# Altium project PCB_Project.PrjPcb
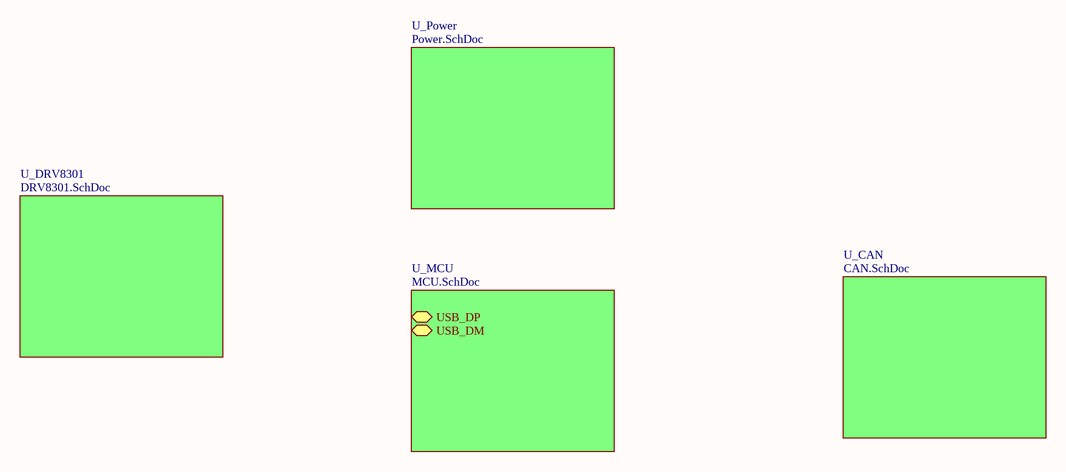
[diagram p0: Main.SchDoc]
6 sheets, 106 parts. Net scope: hierarchical (ports join the sheet entries above them; power ports are global).
Board file: PCB1.PcbDoc
Sheets:
  Main.SchDoc
    U_DRV8301 = DRV8301.SchDoc
    U_MCU = MCU.SchDoc
    U_CAN = CAN.SchDoc
    U_Power = Power.SchDoc
  NRF.SchDoc

## Sheet Main.SchDoc
size A4

### Sub-sheets
U_CAN = CAN.SchDoc: no entries
U_DRV8301 = DRV8301.SchDoc: no entries
U_MCU = MCU.SchDoc: USB_DP (bidir), USB_DM (bidir)
U_Power = Power.SchDoc: no entries

## Sheet DRV8301.SchDoc
size A4
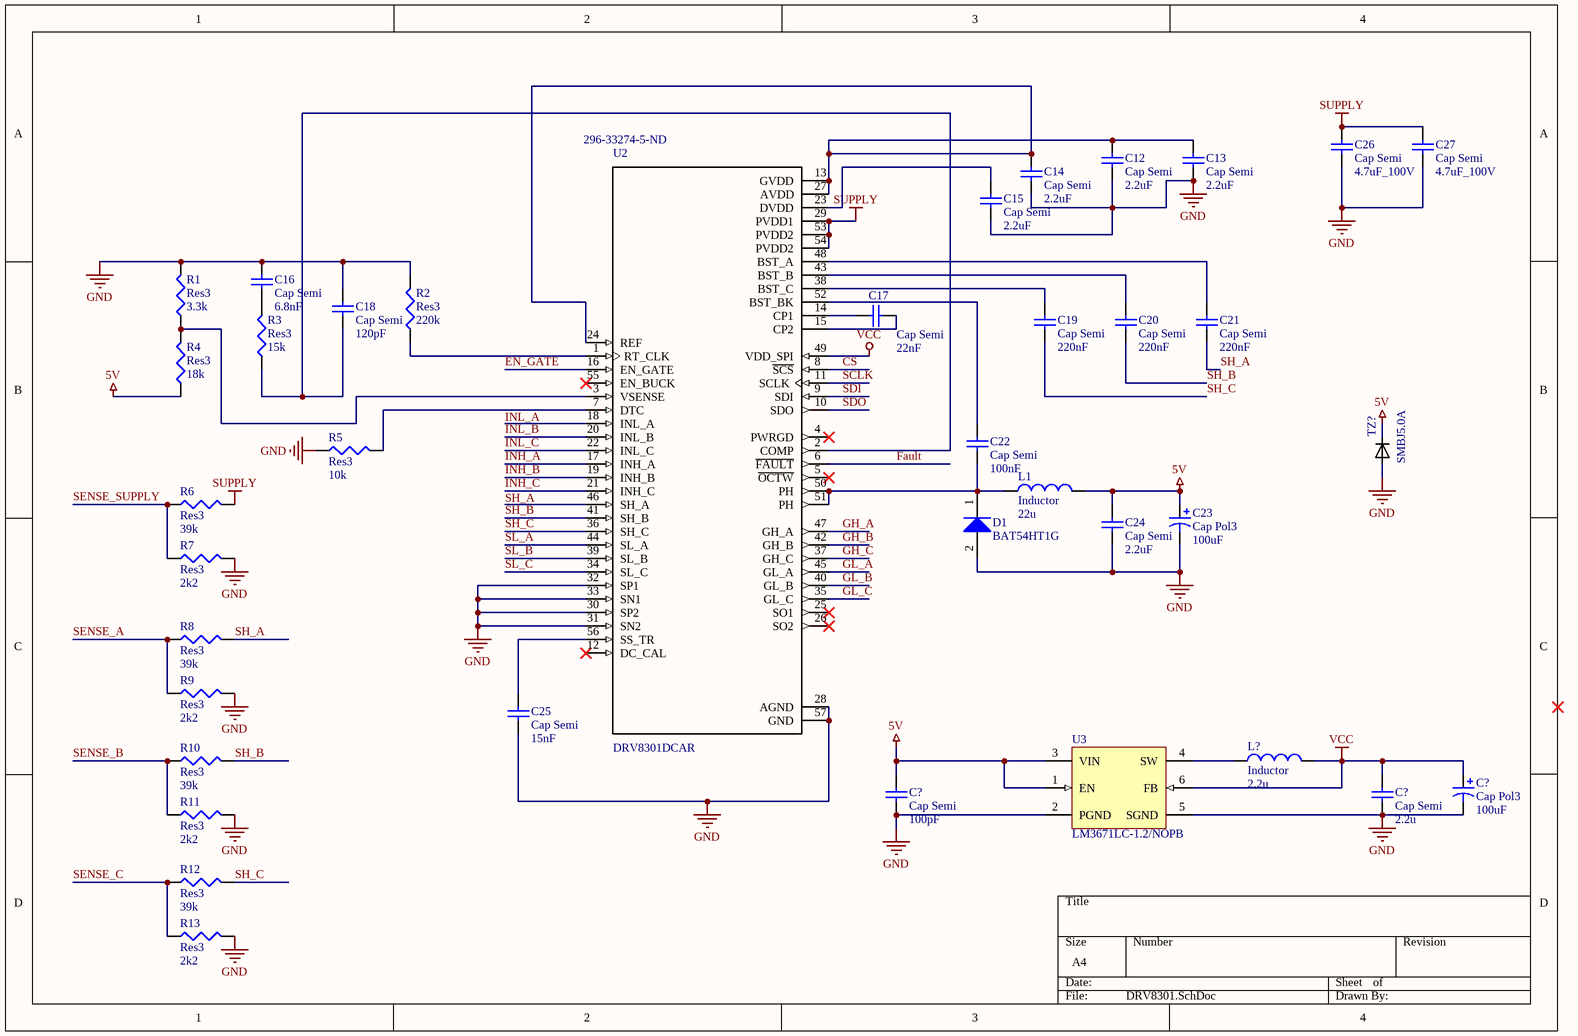
[diagram p1: DRV8301.SchDoc]

### Parts
(Parts that share a designator on the sheet are numbered #1, #2 ... from top to bottom, then left to right.)
C12  Cap Semi  value 2.2uF  [C1206]
C13  Cap Semi  value 2.2uF  [C1206]
C14  Cap Semi  value 2.2uF  [C1206]
C15  Cap Semi  value 2.2uF  [C1206]
C16  Cap Semi  value 6.8nF  [C1206]
C17  Cap Semi  value 22nF  [C1206]
C18  Cap Semi  value 120pF  [C1206]
C19  Cap Semi  value 220nF  [C1206]
C20  Cap Semi  value 220nF  [C1206]
C21  Cap Semi  value 220nF  [C1206]
C22  Cap Semi  value 100nF  [C1206]
C23  Cap Pol3  value 100uF  [C0805]
C24  Cap Semi  value 2.2uF  [C1206]
C25  Cap Semi  value 15nF  [C1206]
C26  Cap Semi  value 4.7uF_100V  [C1206]
C27  Cap Semi  value 4.7uF_100V  [C1206]
C?#1  Cap Pol3  value 100uF  [C0805]
C?#2  Cap Semi  value 100pF  [C1206]
C?#3  Cap Semi  value 2.2u  [C1206]
D1  BAT54HT1G  [ONSC-SOD-323-2-477-02_V]
L1  Inductor  value 22u  [0402-A]
L?  Inductor  value 2.2u  [0402-A]
R1  Res3  value 3.3k  [J1-0603]
R2  Res3  value 220k  [J1-0603]
R3  Res3  value 15k  [J1-0603]
R4  Res3  value 18k  [J1-0603]
R5  Res3  value 10k  [J1-0603]
R6  Res3  value 39k  [J1-0603]
R7  Res3  value 2k2  [J1-0603]
R8  Res3  value 39k  [J1-0603]
R9  Res3  value 2k2  [J1-0603]
R10  Res3  value 39k  [J1-0603]
R11  Res3  value 2k2  [J1-0603]
R12  Res3  value 39k  [J1-0603]
R13  Res3  value 2k2  [J1-0603]
TZ?  SMBJ5.0A  [*SMB_SMBJ5.0A(Primary)]
U2  DRV8301DCAR  Supplier Part Number 1: 296-33274-5-ND  [*SOP50P810X120-57N]
U3  LM3671LC-1.2/NOPB  [NKH0006B_V]

### Nets
5V: C23.1 C24.2 C?#2.2 L1.2 R4.1 TZ?.C U3.1(EN) U3.3(VIN)
GND: C12.2 C13.2 C14.2 C15.2 C16.2 C18.2 C23.2 C24.1 C25.2 C26.1 C27.1 C?#1.2 C?#2.1 C?#3.1 D1.2(A) R1.2 R2.2 R5.1 R7.2 R9.2 R11.2 R13.2 TZ?.A U2.28(AGND) U2.30(SP2) U2.31(SN2) U2.32(SP1) U2.33(SN1) U2.57(GND) U3.2(PGND) U3.5(SGND)
SUPPLY: C26.2 C27.2 R6.2 U2.29(PVDD1) U2.53(PVDD2) U2.54(PVDD2)
VCC: C?#1.1 C?#3.2 L?.2 U2.49(VDD_SPI) U3.6(FB)
CS: U2.8(~{SCS})
EN_GATE: U2.16(EN_GATE)
Fault: U2.6(~{FAULT})
GH_A: U2.47(GH_A)
GH_B: U2.42(GH_B)
GH_C: U2.37(GH_C)
GL_A: U2.45(GL_A)
GL_B: U2.40(GL_B)
GL_C: U2.35(GL_C)
INH_A: U2.17(INH_A)
INH_B: U2.19(INH_B)
INH_C: U2.21(INH_C)
INL_B: U2.20(INL_B)
INL_C: U2.22(INL_C)
SCLK: U2.11(SCLK)
SDI: U2.9(SDI)
SDO: U2.10(SDO)
SENSE_A: R8.1 R9.1
SENSE_B: R10.1 R11.1
SENSE_C: R12.1 R13.1
SENSE_SUPPLY: R6.1 R7.1
SH_A: C21.2 R8.2
SH_B: C20.2 R10.2 U2.41(SH_B)
SH_C: C19.2 R12.2 U2.36(SH_C)
SL_A: U2.44(SL_A)
SL_B: U2.39(SL_B)
SL_C: U2.34(SL_C)
NetC12_1: C12.1 C13.1 C14.1 U2.13(GVDD) U2.24(REF) U2.27(AVDD)
NetC15_1: C15.1 U2.23(DVDD)
NetC16_1: C16.1 R3.2
NetC17_1: C17.1 U2.14(CP1)
NetC17_2: C17.2 U2.15(CP2)
NetC18_1: C18.1 R3.1 U2.2(COMP)
NetC19_1: C19.1 U2.38(BST_C)
NetC20_1: C20.1 U2.43(BST_B)
NetC21_1: C21.1 U2.48(BST_A)
NetC22_1: C22.1 D1.1(K) L1.1 U2.50(PH) U2.51(PH)
NetC22_2: C22.2 U2.52(BST_BK)
NetC25_1: C25.1 U2.56(SS_TR)
NetL?_1: L?.1 U3.4(SW)
NetR1_1: R1.1 R4.2 U2.3(VSENSE)
NetR2_1: R2.1 U2.1(RT_CLK)
NetR5_2: R5.2 U2.7(DTC)

Not connected (* = marked no-connect by the designer): U2 4(PWRGD)* 5(~{OCTW})* 12(DC_CAL)* 18(INL_A) 25(SO1)* 26(SO2)* 46(SH_A) 55(EN_BUCK)*

### Notes on the sheet
- Labels drawn without touching a wire or pin: INL_A, SH_A

### Library data of the parts
C12-C22 C24-C27 C?#2 C?#3 = Cap Semi: Capacitor (Semiconductor SIM Model); Published: 8-Jun-2000; LatestRevisionDate: 29-May-2009; LatestRevisionNote: IPC-7351 Footprint Added.; PackageReference: C1206; Publisher: Altium Limited; PackageDescription: Chip Capacitor
C23 C?#1 = Cap Pol3: Polarized Capacitor (Surface Mount); Published: 8-Jun-2000; LatestRevisionDate: 29-May-2009; LatestRevisionNote: IPC-7351 Footprint Added.; PackageReference: C0805; Publisher: Altium Limited; PackageDescription: Chip Capacitor
D1 = CMP-1055-00462-1: Schottky Barrier Diode, 2-Pin SOD-323, Pb-Free, Tape and Reel; Manufacturer: On Semiconductor; Configuration: Single; trr Max (ns): 5; IFSM Max (A): 0.6; ComponentLink3URL: http://www.onsemi.com/pub_link/Collateral/477-02.PDF.1; PackageDescription: 2-Pin SOD, Body 1.7 x 1.25 mm; ComponentLink2URL: http://www.onsemi.cn/pub_link/Collateral/BAT54HT1-D.PDF; ComponentLink3Description: Package Specification; ComponentLink2Description: Datasheet; DatasheetVersion: Rev. 6; PackageReference: SOD-323-2-477-02; RoHS: TRUE; ComponentLink1URL: http://www.onsemi.com/; Packing: Tape and Reel; PartNumber: BAT54HT1G; Mounting Technology: Surface Mount; ComponentLink1Description: Manufacturer URL; PackageVersion: Rev. H, 03/2007
L1 L? = Inductor: Code_IEC: 1005; Published: 8-Jun-2000; LatestRevisionDate: 29-May-2009; LatestRevisionNote: IPC-7351 Footprint Added.; PackageReference: 0402-A; Publisher: Altium Limited; PackageDescription: Chip Inductor; Code_JEITA: 0402
R1-R13 = Res3: Resistor; Published: 8-Jun-2000; LatestRevisionDate: 29-May-2009; LatestRevisionNote: IPC-7351 Footprint Added.; PackageReference: J1-0603; Publisher: Altium Limited; PackageDescription: Chip Resistor
TZ? = SMBJ5.0A: 9.2V Clamp 65.3A Ipp Tvs Diode Surface Mount SMB _DO-214AA_; MF: Littelfuse; SnapEDA_Link: https://www.snapeda.com/parts/SMBJ5.0A/Littelfuse%20Inc/view-part/225678/?ref=snap; Price: None; Availability: Unavailable; MP: SMBJ5.0A; Package: DO-214 Bourns; Value: *
U2 = DRV8301DCAR: Motor Driver Power MOSFET SPI 56-HTSSOP; MF: Texas Instruments; MP: DRV8301DCAR; Package: HTSSOP-56 Texas Instruments; SnapEDA_Link: https://www.snapeda.com/parts/DRV8301DCAR/Texas%20Instruments/view-part/46687/?ref=snap; Price: None; Availability: Unavailable; Value: *; Supplier 1: Digi-Key
U3 = CMP-0063-00712-3: 2MHz, 600mA Step-Down DC-DC Converter, 6-pin LLP COL, Pb-Free; Manufacturer: Texas Instruments; PackageTopMarking: XTT*S39; PowerWise: N; CompType: MiscPower; RoHS: Y; PackageReference: NKH0006B; ComponentLink1URL: http://www.ti.com/general/docs/lit/getliterature.tsp?genericPartNumber=LM3671&fileType=pdf; PinCount: 6; PackageDescription: LLP, 2 x 2 x 0.6mm, 6 Lead, 0.5mm Pitch, No Pullback; ComponentLink1Description: Datasheet URL

## Sheet MCU.SchDoc
size A4
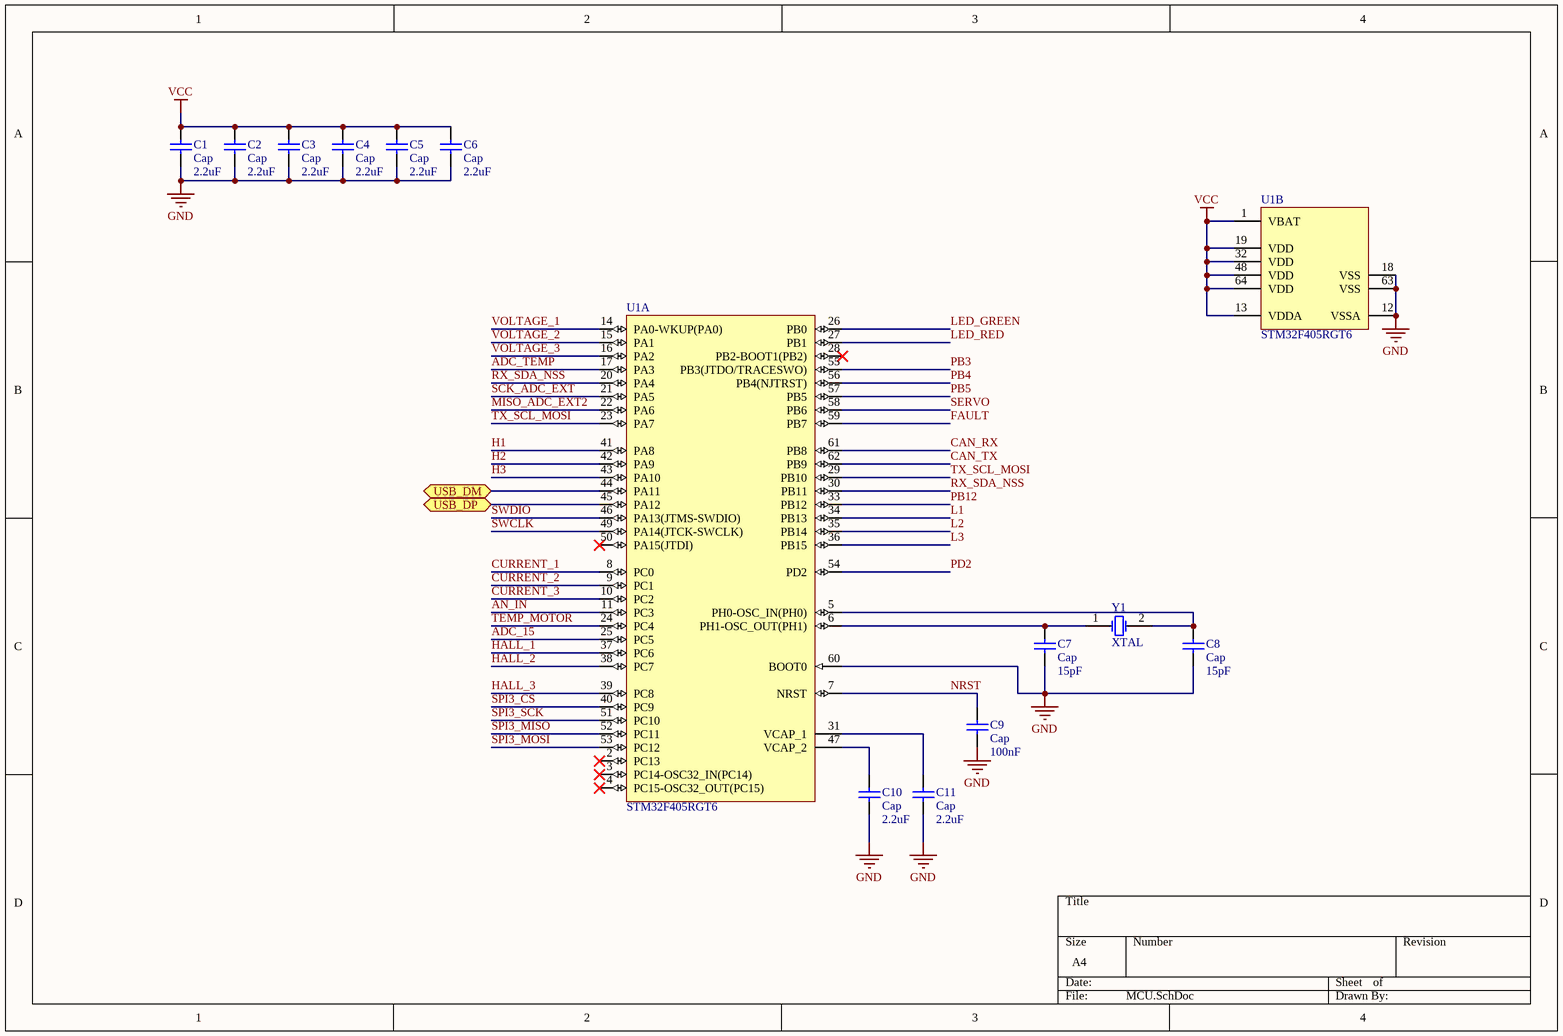
[diagram p2: MCU.SchDoc]

### Parts
C1  Cap  value 2.2uF  [RAD-0.3]
C2  Cap  value 2.2uF  [RAD-0.3]
C3  Cap  value 2.2uF  [RAD-0.3]
C4  Cap  value 2.2uF  [RAD-0.3]
C5  Cap  value 2.2uF  [RAD-0.3]
C6  Cap  value 2.2uF  [RAD-0.3]
C7  Cap  value 15pF  [RAD-0.3]
C8  Cap  value 15pF  [RAD-0.3]
C9  Cap  value 100nF  [RAD-0.3]
C10  Cap  value 2.2uF  [RAD-0.3]
C11  Cap  value 2.2uF  [RAD-0.3]
U1  STM32F405RGT6  [STM-LQFP64_M]  (parts A,B of 2)
Y1  XTAL  [R38]

### Ports
USB_DM (bidir), USB_DP (bidir)

### Nets
GND: C1.1 C2.1 C3.1 C4.1 C5.1 C6.1 C7.1 C8.1 C9.1 C10.1 C11.1 U1.12(VSSA) U1.18(VSS) U1.60(BOOT0) U1.63(VSS)
VCC: C1.2 C2.2 C3.2 C4.2 C5.2 C6.2 U1.1(VBAT) U1.13(VDDA) U1.19(VDD) U1.32(VDD) U1.48(VDD) U1.64(VDD)
ADC_15: U1.25(PC5)
ADC_TEMP: U1.17(PA3)
AN_IN: U1.11(PC3)
CAN_RX: U1.61(PB8)
CAN_TX: U1.62(PB9)
CURRENT_1: U1.8(PC0)
CURRENT_2: U1.9(PC1)
CURRENT_3: U1.10(PC2)
FAULT: U1.59(PB7)
H1: U1.41(PA8)
H2: U1.42(PA9)
H3: U1.43(PA10)
HALL_1: U1.37(PC6)
HALL_2: U1.38(PC7)
HALL_3: U1.39(PC8)
L1: U1.34(PB13)
L2: U1.35(PB14)
L3: U1.36(PB15)
LED_GREEN: U1.26(PB0)
LED_RED: U1.27(PB1)
MISO_ADC_EXT2: U1.22(PA6)
NRST: C9.2 U1.7(NRST)
PB3: U1.55(PB3(JTDO/TRACESWO))
PB4: U1.56(PB4(NJTRST))
PB5: U1.57(PB5)
PB12: U1.33(PB12)
PD2: U1.54(PD2)
RX_SDA_NSS: U1.20(PA4) U1.30(PB11)
SCK_ADC_EXT: U1.21(PA5)
SERVO: U1.58(PB6)
SPI3_CS: U1.40(PC9)
SPI3_MISO: U1.52(PC11)
SPI3_MOSI: U1.53(PC12)
SPI3_SCK: U1.51(PC10)
SWCLK: U1.49(PA14(JTCK-SWCLK))
SWDIO: U1.46(PA13(JTMS-SWDIO))
TEMP_MOTOR: U1.24(PC4)
TX_SCL_MOSI: U1.23(PA7) U1.29(PB10)
VOLTAGE_1: U1.14(PA0-WKUP(PA0))
VOLTAGE_2: U1.15(PA1)
VOLTAGE_3: U1.16(PA2)
NetC7_2: C7.2 U1.6(PH1-OSC_OUT(PH1)) Y1.1(OSC1)
NetC8_2: C8.2 U1.5(PH0-OSC_IN(PH0)) Y1.2(OSC2)
NetC10_2: C10.2 U1.47(VCAP_2)
NetC11_2: C11.2 U1.31(VCAP_1)
NetU1_44: U1.44(PA11) ; port USB_DM
NetU1_45: U1.45(PA12) ; port USB_DP

Not connected (* = marked no-connect by the designer): U1 2(PC13)* 3(PC14-OSC32_IN(PC14))* 4(PC15-OSC32_OUT(PC15))* 28(PB2-BOOT1(PB2))* 50(PA15(JTDI))*

### Library data of the parts
C1-C11 = Cap: Capacitor; Published: 8-Jun-2000; LatestRevisionDate: 17-Jul-2002; LatestRevisionNote: Re-released for DXP Platform.; PackageReference: RAD-0.3; Publisher: Altium Limited; PackageDescription: Radial Cap, Thru-Hole; 2 Leads; 0.3 in Pin Spacing
U1 = CMP-0243-00019-3: ARM Cortex-M4 32-bit MCU+FPU, 210 DMIPS, 1024 kB Flash, 192 kB Internal RAM, 51 I/Os, 64-pin LQFP, -40 to 85 degC, Tray; Manufacturer: STMicroelectronics; Supply Voltage(Vcc) min (V): 1.8; Supply Voltage(Vcc) max (V): 3.6; Internal RAM Size (kB): 192; I/Os (High Current): 51; D/A Converter: 2x12-bit; FLASH Size (Prog) (kB): 1024; Operating Frequency(F) (Processor speed) (MHz): 168; ComponentLink2Description: Datasheet; PackageVersion: Rev. 4, 06/2013; DatasheetVersion: Rev. 4; Core: ARM Cortex-M4; ComponentLink2URL: http://www.st.com/st-web-ui/static/active/en/resource/technical/document/datasheet/DM00037051.pdf; PackageReference: LQFP64; Packing: Tray; ComponentLink1Description: Manufacturer URL; ComponentLink3URL: http://www.st.com/st-web-ui/static/active/en/resource/technical/document/datasheet/DM00037051.pdf; ComponentLink3Description: Package Specification; Mounting Technology: Surface Mount; ComponentLink1URL: http://www.st.com/web/en/home.html; PackageDescription: 64-Pin Low Profile Quad Flat Package, 10 x 10 mm Body, 0.5 mm Pitch; PartNumber: STM32F405RGT6
Y1 = XTAL: Crystal Oscillator; Published: 8-Jun-2000; LatestRevisionDate: 17-Jul-2002; LatestRevisionNote: Re-released for DXP Platform.; PackageReference: R38; Publisher: Altium Limited; PackageDescription: Crystal, Thru-Hole; 2 Leads; Body 3.1 x 8.2 mm (Dia.xH)

## Sheet CAN.SchDoc
size A4
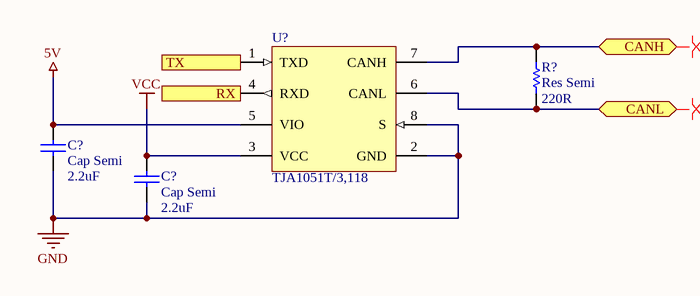
[diagram p3: CAN.SchDoc]

### Parts
(Parts that share a designator on the sheet are numbered #1, #2 ... from top to bottom, then left to right.)
C?#4  Cap Semi  value 2.2uF  [C1206]
C?#5  Cap Semi  value 2.2uF  [C1206]
R?#1  Res Semi  value 220R  [AXIAL-0.5]
U?#1  TJA1051T/3,118  [NXP-SOIC-8_L]

### Ports
CANH (bidir), CANL (bidir), RX (out), TX (in)

### Nets
5V: C?#4.1 U?#1.5(VIO)
GND: C?#4.2 C?#5.1 U?#1.2(GND) U?#1.8(S)
VCC: C?#5.2 U?#1.3(VCC)
NetR?#1_1: R?#1.1 U?#1.6(CANL) ; port CANL
NetR?#1_2: R?#1.2 U?#1.7(CANH) ; port CANH
NetU?#1_1: U?#1.1(TXD) ; port TX
NetU?#1_4: U?#1.4(RXD) ; port RX

### Layout directives
differential pair: NetR?#1_1, NetR?#1_2

### Library data of the parts
C?#4 C?#5 = Cap Semi: Capacitor (Semiconductor SIM Model); Published: 8-Jun-2000; LatestRevisionDate: 29-May-2009; LatestRevisionNote: IPC-7351 Footprint Added.; PackageReference: C1206; Publisher: Altium Limited; PackageDescription: Chip Capacitor
R?#1 = Res Semi: Semiconductor Resistor; Published: 8-Jun-2000; LatestRevisionDate: 17-Jul-2002; LatestRevisionNote: Re-released for DXP Platform.; PackageReference: AXIAL-0.5; Publisher: Altium Limited; PackageDescription: Axial Device, Thru-Hole; 2 Leads; 0.5 in Pin Spacing
U?#1 = CMP-2000-07245-1: High-Speed CAN Transceiver, 3 to 5 V, 8-Pin SOIC (SOT96-1), RoHS, Tape and Reel; Manufacturer: NXP; Power Down Mode: Normal/Silent; Rad Hardened: No; Number of Transceivers: 1; Supply Current: 70mA; Operating Supply Voltage (Max): 5.5V; Operating Supply Voltage (Typ): 5V; Operating Supply Voltage (Min): 4.5V; Standard Supported: ISO11898-2; Data Rate: 1Mbps; DELETED: Compliant; Operating Temperature (Min): -40C; Datasheet Version: Rev. 7, 01/2015; Pin Count: 8; Operating Temperature (Max): 125C; Package Description: 8-Pin Small Outline Integrated Circuit, Body 4.9 x 3.9 mm, Pitch 1.27 mm; Category: Transceiver; Packaging: TapeandReel; Mounting: SurfaceMount; Package Reference: SOT96-1; Operating Temperature Classification: Automotive; Mounting Technology: SurfaceMount; Package Type: SO; Manufacturer URL: http://www.nxp.com/; Datasheet URL: http://www.nxp.com/documents/data_sheet/TJA1051.pdf

## Sheet Power.SchDoc
size A4
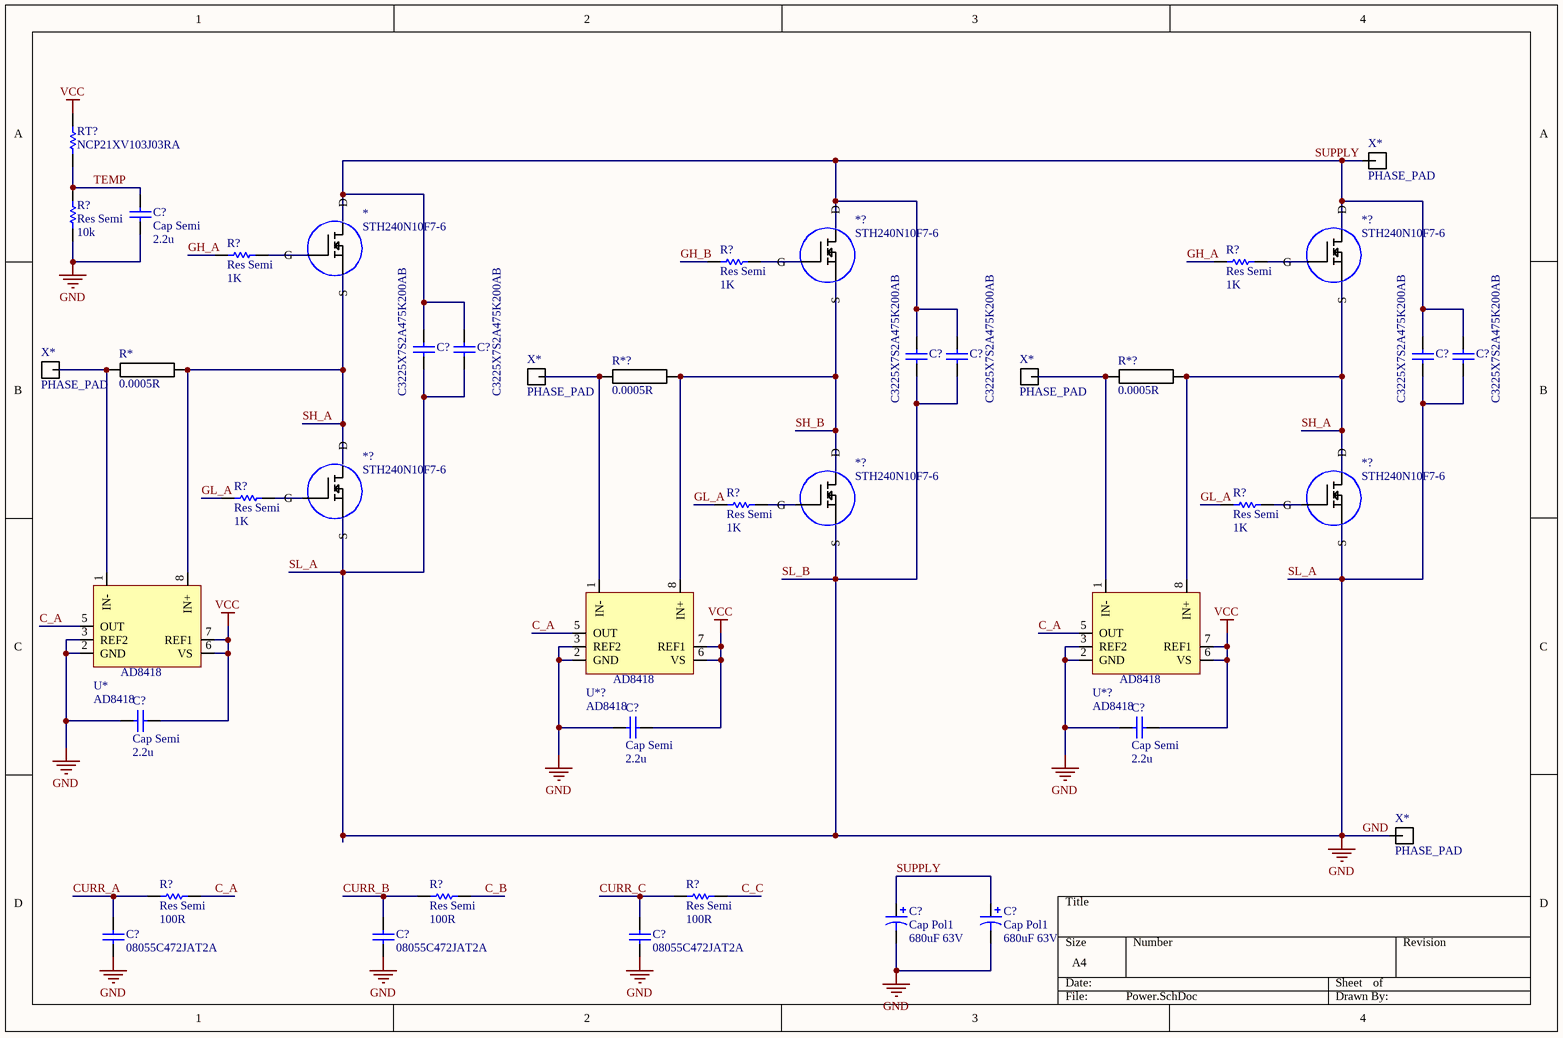
[diagram p4: Power.SchDoc]

### Parts
(Parts that share a designator on the sheet are numbered #1, #2 ... from top to bottom, then left to right.)
*  STH240N10F7-6  [*TO-263-7]
*?#1  STH240N10F7-6  [*TO-263-7]
*?#2  STH240N10F7-6  [*TO-263-7]
*?#3  STH240N10F7-6  [*TO-263-7]
*?#4  STH240N10F7-6  [*TO-263-7]
*?#5  STH240N10F7-6  [*TO-263-7]
C?#6  Cap Semi  value 2.2u  [C1206]
C?#7  C3225X7S2A475K200AB  [CAPC3225X220X20ML40]
C?#8  C3225X7S2A475K200AB  [CAPC3225X220X20ML40]
C?#9  C3225X7S2A475K200AB  [CAPC3225X220X20ML40]
C?#10  C3225X7S2A475K200AB  [CAPC3225X220X20ML40]
C?#11  C3225X7S2A475K200AB  [CAPC3225X220X20ML40]
C?#12  C3225X7S2A475K200AB  [CAPC3225X220X20ML40]
C?#13  Cap Semi  value 2.2u  [C1206]
C?#14  Cap Semi  value 2.2u  [C1206]
C?#15  Cap Semi  value 2.2u  [C1206]
C?#16  Cap Pol1  value 680uF 63V  [RB7.6-15]
C?#17  Cap Pol1  value 680uF 63V  [RB7.6-15]
C?#18  08055C472JAT2A  [CAPC2013X94X50NL20T25]
C?#19  08055C472JAT2A  [CAPC2013X94X50NL20T25]
C?#20  08055C472JAT2A  [CAPC2013X94X50NL20T25]
R*  0.0005R  [*RESC5125X80N]
R*?#1  0.0005R  [*RESC5125X80N]
R*?#2  0.0005R  [*RESC5125X80N]
R?#2  Res Semi  value 10k  [AXIAL-0.5]
R?#3  Res Semi  value 1K  [AXIAL-0.5]
R?#4  Res Semi  value 1K  [AXIAL-0.5]
R?#5  Res Semi  value 1K  [AXIAL-0.5]
R?#6  Res Semi  value 1K  [AXIAL-0.5]
R?#7  Res Semi  value 1K  [AXIAL-0.5]
R?#8  Res Semi  value 1K  [AXIAL-0.5]
R?#9  Res Semi  value 100R  [AXIAL-0.5]
R?#10  Res Semi  value 100R  [AXIAL-0.5]
R?#11  Res Semi  value 100R  [AXIAL-0.5]
RT?  NCP21XV103J03RA  [RESC2013X100X45LL20T25]
U*  AD8418  [*SOP65P490X110-8N]
U*?#1  AD8418  [*SOP65P490X110-8N]
U*?#2  AD8418  [*SOP65P490X110-8N]
X*#1  PHASE_PAD  [PHASE_PAD]
X*#2  PHASE_PAD  [PHASE_PAD]
X*#3  PHASE_PAD  [PHASE_PAD]
X*#4  PHASE_PAD  [PHASE_PAD]
X*#5  PHASE_PAD  [PHASE_PAD]

### Nets
GND: *?#3.S *?#4.S *?#5.S C?#6.1 C?#7.1 C?#8.1 C?#9.1 C?#10.1 C?#11.1 C?#12.1 C?#13.1 C?#14.1 C?#15.1 C?#16.2 C?#17.2 C?#18.1 C?#19.1 C?#20.1 R?#2.1 U*.2(GND) U*.3(REF2) U*?#1.2(GND) U*?#1.3(REF2) U*?#2.2(GND) U*?#2.3(REF2)  [also labelled SL_A, SL_B]
VCC: C?#13.2 C?#14.2 C?#15.2 RT?.2 U*.6(VS) U*.7(REF1) U*?#1.6(VS) U*?#1.7(REF1) U*?#2.6(VS) U*?#2.7(REF1)
C_A: R?#9.2 U*.5(OUT) U*?#1.5(OUT) U*?#2.5(OUT)
C_B: R?#10.2
C_C: R?#11.2
CURR_A: C?#18.2 R?#9.1
CURR_B: C?#19.2 R?#10.1
CURR_C: C?#20.2 R?#11.1
GH_A: R?#3.1 R?#5.1
GH_B: R?#4.1
GL_A: R?#6.1 R?#7.1 R?#8.1
SH_A: *.S *?#2.S *?#3.D *?#5.D R*.1 R*?#2.1 U*.8(IN+) U*?#2.8(IN+)
SH_B: *?#1.S *?#4.D R*?#1.1 U*?#1.8(IN+)
SUPPLY: *.D *?#1.D *?#2.D C?#7.2 C?#8.2 C?#9.2 C?#10.2 C?#11.2 C?#12.2 C?#16.1 C?#17.1
TEMP: C?#6.2 R?#2.2 RT?.1
Net*?#1_G: *?#1.G R?#4.2
Net*?#2_G: *?#2.G R?#5.2
Net*_G: *.G R?#3.2
NetR*?#1_2: R*?#1.2 U*?#1.1(IN-) X*#3.1
NetR*?#2_2: R*?#2.2 U*?#2.1(IN-) X*#4.1
NetR*_2: R*.2 U*.1(IN-) X*#2.1

Not connected (* = marked no-connect by the designer): *?#3 G; *?#4 G; *?#5 G; R?#6 2; R?#7 2; R?#8 2; X*#1 1; X*#5 1

### Library data of the parts
C?#6 C?#13-C?#15 = Cap Semi: Capacitor (Semiconductor SIM Model); Published: 8-Jun-2000; LatestRevisionDate: 29-May-2009; LatestRevisionNote: IPC-7351 Footprint Added.; PackageReference: C1206; Publisher: Altium Limited; PackageDescription: Chip Capacitor
C?#7-C?#12 = CMP-2000-05456-1: Chip Capacitor, 4.7 uF, +/- 10%, 100 V, -55 to 125 degC, 1210 (3225 Metric), RoHS, Tape and Reel; PCN Part Number: MLCCPartNumberChange30/Nov/2012; Manufacturer: TDK; Featured Product: MidVoltageX7S-100VMLCCsC-SeriesMidVoltageMLCCs; Capacitance: 4.7µF; Catalog Drawings: CSERIES_1210_2.2; Product Training Modules: SEAT,CCV,andTVCLDesignToolsCSeriesMidVoltageCapacitorsFamilyGuidetoReplacinganElectrolyticCapacitorwithanMLCC; Voltage - Rated: 100V; Temperature Coefficient: X7S; Other Names: 445-6042-1; Online Catalog: CSeries,MidVoltage; Kits: 445-9009-KIT-ND-KITCAPCERHICAP100V-630VSMD; Mounting Type: SurfaceMount,MLCC; Ratings: -; Lead Spacing: -; Package Reference: 3225; Thickness (Max): 0.087"(2.20mm); Features: -; Category: Capacitors; Size / Dimension: 0.126"Lx0.098"W(3.20mmx2.50mm); Tolerance: ±10%; Series: C; Datasheet URL: http://download.siliconexpert.com/pdfs/2013/1/31/7/41/13/446/tdk_/manual/c3225x7s2a475k200ab.pdf; Lead Style: -; Manufacturer URL: http://www.tdk.com/; RoHS Information: RoHSCertificate-MLCC; Datasheet Version: Jan-13; Package / Case: 1210(3225Metric); Package Description: 2-Pin Surface Mount Device, Body 3.2 x 2.5 mm; Standard Package: 1; Applications: GeneralPurpose; Packaging: CutTape(CT); Family: CeramicCapacitors; Height - Seated (Max): -; Operating Temperature: -55degC~125degC
C?#16 C?#17 = Cap Pol1: Polarized Capacitor (Radial); Published: 8-Jun-2000; LatestRevisionDate: 17-Jul-2002; LatestRevisionNote: Re-released for DXP Platform.; PackageReference: RB7.6-15; Publisher: Altium Limited; PackageDescription: Polarized Capacitor (Radial); 2 Leads
C?#18-C?#20 = CMP-2007-04421-1: Manufacturer: AVX Interconnect / Elco; Part Number: 08055C472JAT2A
R?#2-R?#11 = Res Semi: Semiconductor Resistor; Published: 8-Jun-2000; LatestRevisionDate: 17-Jul-2002; LatestRevisionNote: Re-released for DXP Platform.; PackageReference: AXIAL-0.5; Publisher: Altium Limited; PackageDescription: Axial Device, Thru-Hole; 2 Leads; 0.5 in Pin Spacing
RT? = CMP-2000-06827-1: Chip Thermistor, 10 KOhm, +/- 5%, 200 mW, -40 to 125 degC, 0805 (2012 Metric), RoHS, Tape and Reel; Manufacturer: Murata; Rated Current: 0.44mA; B-constant: 3934K; Resistance: 10kO; Datasheet URL: http://www.murata.com/~/media/webrenewal/support/library/catalog/products/thermistor/ntc/r44e.ashx; Tolerance (%): ±5%; Package Description: 2-Pin Surface Mount Device, Body 2 x 1.25 mm; Temperature Range: -40to+125°C; Manufacturer URL: http://www.murata.com/; Mounting Technology: SurfaceMount; Type: NTC; Package Reference: 0805; Datasheet Version: 12/2014

## Sheet NRF.SchDoc
size A4
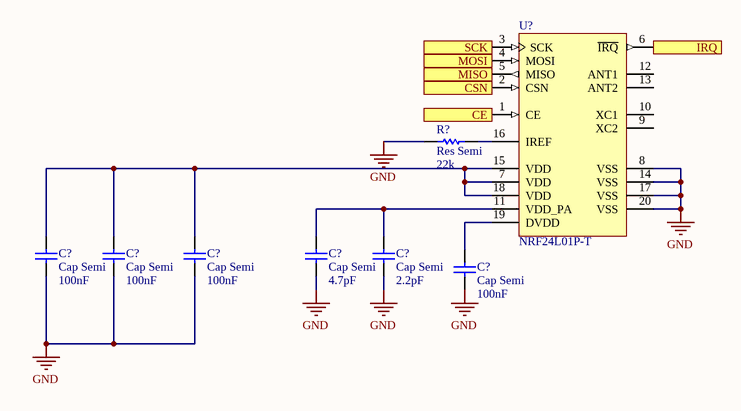
[diagram p5: NRF.SchDoc]

### Parts
(Parts that share a designator on the sheet are numbered #1, #2 ... from top to bottom, then left to right.)
C?#21  Cap Semi  value 100nF  [C1206]
C?#22  Cap Semi  value 100nF  [C1206]
C?#23  Cap Semi  value 100nF  [C1206]
C?#24  Cap Semi  value 4.7pF  [C1206]
C?#25  Cap Semi  value 2.2pF  [C1206]
C?#26  Cap Semi  value 100nF  [C1206]
R?#12  Res Semi  value 22k  [AXIAL-0.5]
U?#2  NRF24L01P-T  [NRSC-QFN-20_L]

### Ports
CE (in), CSN (in), IRQ (out), MISO (out), MOSI (in), SCK (in)

### Nets
GND: C?#21.1 C?#22.1 C?#23.1 C?#24.1 C?#25.1 C?#26.1 R?#12.1 U?#2.8(VSS) U?#2.14(VSS) U?#2.17(VSS) U?#2.20(VSS)
NetC?#21_2: C?#21.2 C?#22.2 C?#23.2 U?#2.7(VDD) U?#2.15(VDD) U?#2.18(VDD)
NetC?#24_2: C?#24.2 C?#25.2 U?#2.11(VDD_PA)
NetC?#26_2: C?#26.2 U?#2.19(DVDD)
NetR?#12_2: R?#12.2 U?#2.16(IREF)
NetU?#2_1: U?#2.1(CE) ; port CE
NetU?#2_2: U?#2.2(CSN) ; port CSN
NetU?#2_3: U?#2.3(SCK) ; port SCK
NetU?#2_4: U?#2.4(MOSI) ; port MOSI
NetU?#2_5: U?#2.5(MISO) ; port MISO
NetU?#2_6: U?#2.6(~{IRQ}) ; port IRQ

Not connected (* = marked no-connect by the designer): U?#2 9(XC2) 10(XC1) 12(ANT1) 13(ANT2)

### Library data of the parts
C?#21-C?#26 = Cap Semi: Capacitor (Semiconductor SIM Model); Published: 8-Jun-2000; LatestRevisionDate: 29-May-2009; LatestRevisionNote: IPC-7351 Footprint Added.; PackageReference: C1206; Publisher: Altium Limited; PackageDescription: Chip Capacitor
R?#12 = Res Semi: Semiconductor Resistor; Published: 8-Jun-2000; LatestRevisionDate: 17-Jul-2002; LatestRevisionNote: Re-released for DXP Platform.; PackageReference: AXIAL-0.5; Publisher: Altium Limited; PackageDescription: Axial Device, Thru-Hole; 2 Leads; 0.5 in Pin Spacing
U?#2 = CMP-2000-06859-1: Single Chip Transceiver, 2.4 GHz, 60 mW, 1.9 to 3.6 V, -40 to 85 degC, 20-Pin QFN, RoHS, Tray; Manufacturer: Nordic Semiconductor; Data Rate (Max): 2Mbps; Current - Transmitting: 7mA~11.3mA; Power - Output: 0dBm; Other Names: 1490-1019; Online Catalog: nRF24L01+; Current - Receiving: 12.6mA~13.5mA; For Use With: 1490-1002-ND-KITEVALUATIONNRF24L01P1568-1295-ND-SPARKFUNTRANSCEIVERBREAKOUT-1568-1296-ND-SPARKFUNTRANSCEIVERBREAKOUT-1471-1410-ND-DEVBOARDNRFSCLICKNRF24L01P-MODULE-PCB-ND-KITEVALNRF24L01+PCBANTENNANRF24L01P-MODULE-SMA-ND-KITEVALNRF24L01+SMACONNNRF24L01P-UPGRADE-ND-UPGRADE2PCB/1SMANRF24L01103990038-ND-DEVDUINOSENSORNODEV1.3103990053-ND-DEVDUINOSENSORNODEV2(ATMEGA103990074-ND-DEVDUINOSENSORNODE106990026-ND-ENERGYMONITORSHIELDV2113990088-ND-WIRELESSGATESHIELD113990095-ND-DEVDUINOSENSORNODEV3(ATMEGA106030001-ND-ENERGYMONITORSHIELD1597-1361-ND-DEVDUINOSENSORNODEV2.2(ATMEG105990030-ND-RGBWSTRIPWIRELESSSHIELDV1.0; Frequency: 2.4GHz; Design Resources: DevelopmentToolSelector; RF Family/Standard: GeneralISM>1GHZ; Serial Interfaces: SPI; Sensitivity: -94dBm; Voltage - Supply: 1.9V~3.6V; Modulation: GFSK; GPIO: -; Package Reference: QFN20; Memory Size: -; Category: RF/IFandRFID; Type: TxRxOnly; Standard Package: 490; Package / Case: 20-VFQFNExposedPad; Packaging: Tray; Series: -; Package Description: 20-Pin Quad Flat No-lead Package, Body 4 x 4 mm, Pitch 0.5 mm; Datasheet Version: Rev. 1.0, 09/2008; Protocol: -; Manufacturer URL: http://www.nordicsemi.com/eng/Products/; Operating Temperature: -40°C~85°C; Family: RFTransceiverICs; Datasheet URL: http://www.nordicsemi.com/eng/content/download/2726/34069/file/nRF24L01P_Product_Specification_1_0.pdf; Mounting Technology: SurfaceMount

## Nets that join several sheets
5V: DRV8301 (8 pins), CAN (C?#4.1 U?#1.5)
GND: DRV8301 (31 pins), MCU (15 pins), CAN (C?#4.2 C?#5.1 U?#1.2 U?#1.8), Power (25 pins), NRF (11 pins)
VCC: DRV8301 (5 pins), MCU (12 pins), CAN (C?#5.2 U?#1.3), Power (10 pins)

## Assembly variants
0: all parts fitted
1: all parts fitted